# EAGLE design Sensor (EAGLE 7.6.0)

## Sheet 1 of 2
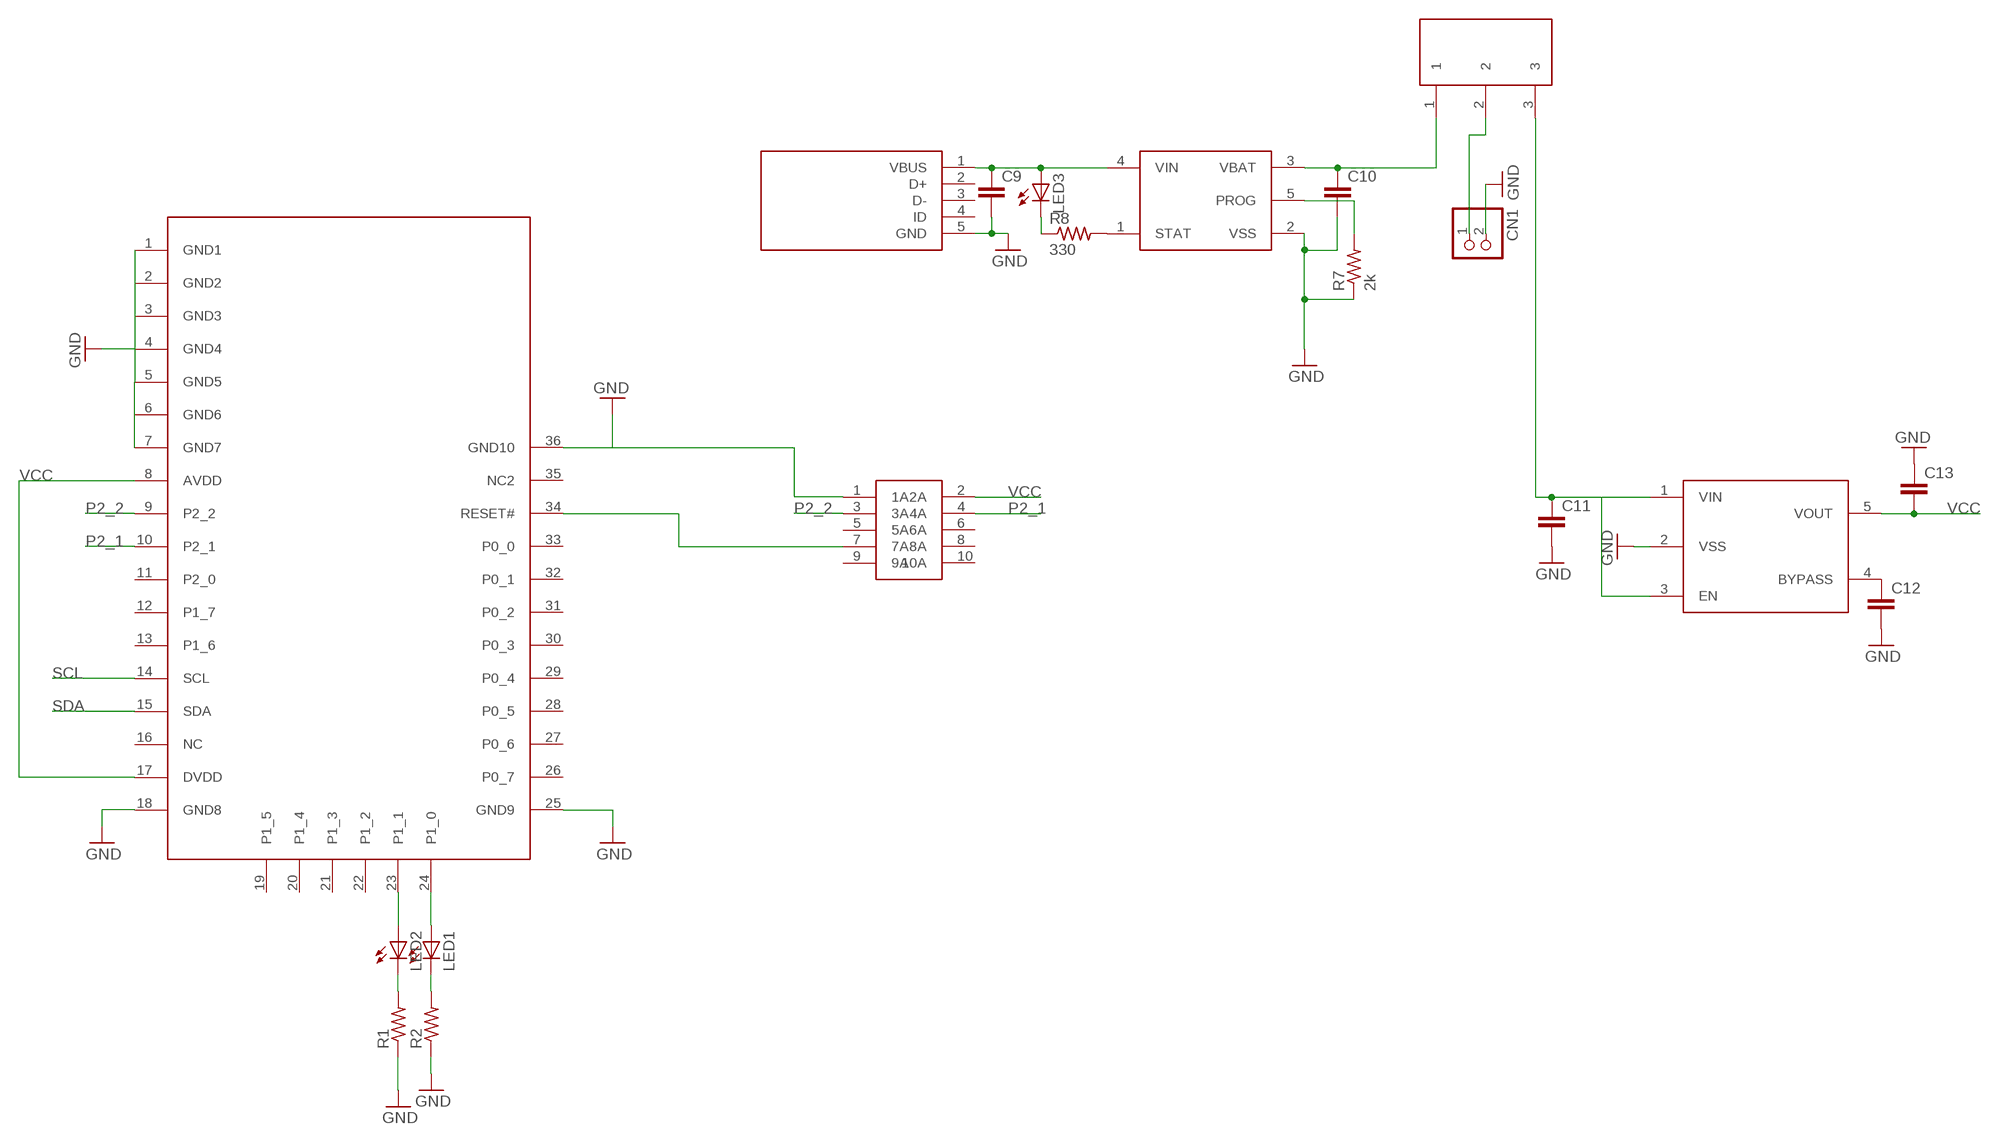
[diagram p0: schematic, sheet 1]

### Parts
C9  C-EUC0402  [C0402]
C10  C-EUC0402  [C0402]
C11  C-EUC0402  [C0402]
C12  C-EUC0402  [C0402]
C13  C-EUC0402  [C0402]
CN1  JST_2PIN-THM  [JST-PH-2-THM]
LED1  LEDCHIP-LED0805  [CHIP-LED0805]
LED2  LEDCHIP-LED0805  [CHIP-LED0805]
LED3  LEDCHIP-LED0805  [CHIP-LED0805]
R1  R-US_R0402  [R0402]
R2  R-US_R0402  [R0402]
R7  2k  R-US_R0402  [R0402]
R8  330  R-US_R0402  [R0402]
U$1  BLE113  [BLUEGIGA]
U$2  MCP73831  [SOT23-5L]
U$8  RIBBON_10POS_MALE  [RIBBON_10POS_MALE]
U$9  SPDT_THRU  [SPDT_THRU]
U$10  USB_MINI  [USB_MINI]
U$11  LP3985  [SOT23-5L]

### Nets
GND: C9.2 C10.2 C11.2 C12.2 C13.1 CN1.2 R1.1 R2.1 R7.1 U$1.1(GND1) U$1.2(GND2) U$1.3(GND3) U$1.4(GND4) U$1.5(GND5) U$1.6(GND6) U$1.7(GND7) U$1.18(GND8) U$1.25(GND9) U$1.36(GND10) U$2.2(VSS) U$8.1(1A) U$10.5(GND) U$11.2(VSS) ; also sheet 2
N$2: C9.1 LED3.A U$2.4(VIN) U$10.1(VBUS)
N$4: C10.1 U$2.3(VBAT) U$9.1
N$5: C11.1 U$9.3 U$11.1(VIN) U$11.3(EN)
N$6: U$1.34(RESET#) U$8.7(7A)
N$7: LED2.C R1.2
N$8: LED1.C R2.2
N$9: LED1.A U$1.24(P1_0)
N$10: LED2.A U$1.23(P1_1)
N$11: CN1.1 U$9.2
N$25: R7.2 U$2.5(PROG)
N$26: C12.1 U$11.4(BYPASS)
N$27: R8.2 U$2.1(STAT)
N$28: LED3.C R8.1
P2_1: U$1.10(P2_1) U$8.4(4A)
P2_2: U$1.9(P2_2) U$8.3(3A)
SCL: U$1.14(SCL) ; also sheet 2
SDA: U$1.15(SDA) ; also sheet 2
VCC: C13.2 U$1.8(AVDD) U$1.17(DVDD) U$8.2(2A) U$11.5(VOUT) ; also sheet 2
Unconnected: U$1.11(P2_0) U$1.12(P1_7) U$1.13(P1_6) U$1.16(NC) U$1.19(P1_5) U$1.20(P1_4) U$1.21(P1_3) U$1.22(P1_2) U$1.26(P0_7) U$1.27(P0_6) U$1.28(P0_5) U$1.29(P0_4) U$1.30(P0_3) U$1.31(P0_2) U$1.32(P0_1) U$1.33(P0_0) U$1.35(NC2) U$8.5(5A) U$8.6(6A) U$8.8(8A) U$8.9(9A) U$8.10(10A) U$10.2(D+) U$10.3(D-) U$10.4(ID)

## Sheet 2 of 2
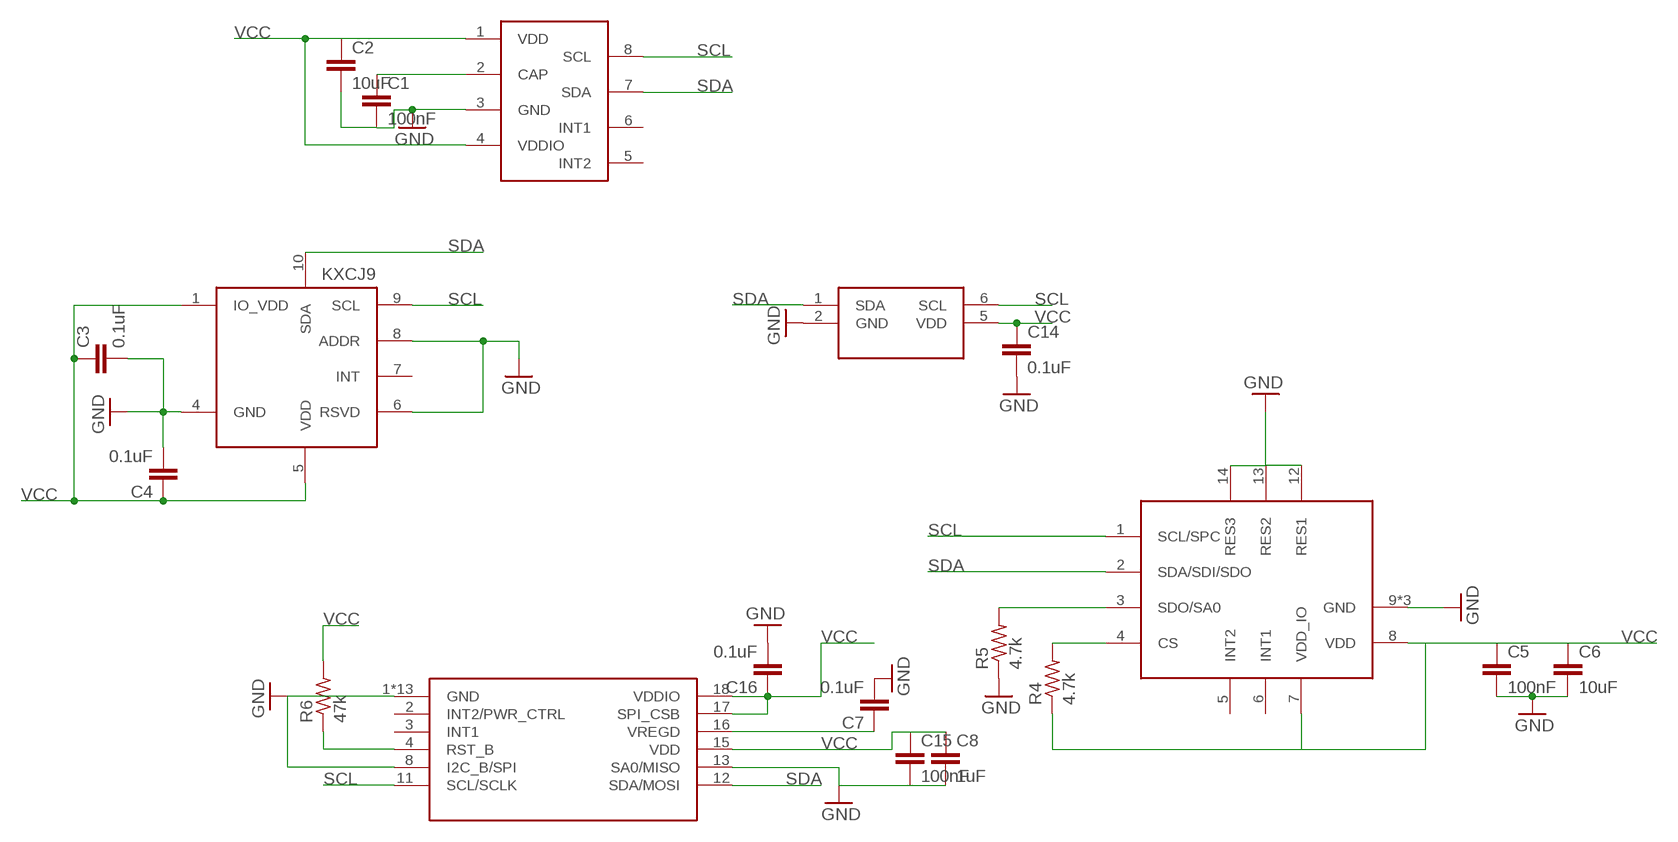
[diagram p1: schematic, sheet 2]

### Parts
ACCEL_16  LISDH_16G  [LGA14_2X2]
C1  100nF  C-EUC0402  [C0402]
C2  10uF  C-EUC0402  [C0402]
C3  0.1uF  C-EUC0402  [C0402]
C4  0.1uF  C-EUC0402  [C0402]
C5  100nF  C-EUC0402  [C0402]
C6  10uF  C-EUC0402  [C0402]
C7  0.1uF  C-EUC0402  [C0402]
C8  1uF  C-EUC0402  [C0402]
C14  0.1uF  C-EUC0402  [C0402]
C15  100nF  C-EUC0402  [C0402]
C16  0.1uF  C-EUC0402  [C0402]
R4  4.7k  R-US_R0402  [R0402]
R5  4.7k  R-US_R0402  [R0402]
R6  47k  R-US_R0402  [R0402]
U$12  KXCJ9  [KXCJ9]
U$13  MLP3115A2  [MLP3115A2]
U$14  FXAS21002  [FXAS21002]
U$15  SI7021-A20  [SI7021-A20]

### Nets
GND: ACCEL_16.9(GND) ACCEL_16.10(GND) ACCEL_16.11(GND) ACCEL_16.12(RES1) ACCEL_16.13(RES2) ACCEL_16.14(RES3) C1.2 C2.2 C3.2 C4.2 C5.2 C6.2 C7.2 C8.2 C14.2 C15.2 C16.2 R5.1 U$12.4(GND) U$12.6(RSVD) U$12.8(ADDR) U$13.3(GND) U$14.1(GND) U$14.5(GND) U$14.6(GND) U$14.7(GND) U$14.8(I2C_B/SPI) U$14.9(GND) U$14.10(GND) U$14.13(SA0/MISO) U$14.14(GND) U$14.19(GND) U$14.20(GND) U$14.21(GND) U$14.22(GND) U$14.23(GND) U$14.24(GND) U$15.2(GND) ; also sheet 1
N$14: C1.1 U$13.2(CAP)
N$15: ACCEL_16.4(CS) R4.2
N$17: ACCEL_16.3(SDO/SA0) R5.2
N$18: R6.1 U$14.4(RST_B)
N$19: C7.1 U$14.16(VREGD)
SCL: ACCEL_16.1(SCL/SPC) U$12.9(SCL) U$13.8(SCL) U$14.11(SCL/SCLK) U$15.6(SCL) ; also sheet 1
SDA: ACCEL_16.2(SDA/SDI/SDO) U$12.10(SDA) U$13.7(SDA) U$14.12(SDA/MOSI) U$15.1(SDA) ; also sheet 1
VCC: ACCEL_16.7(VDD_IO) ACCEL_16.8(VDD) C2.1 C3.1 C4.1 C5.1 C6.1 C8.1 C14.1 C15.1 C16.1 R4.1 R6.2 U$12.1(IO_VDD) U$12.5(VDD) U$13.1(VDD) U$13.4(VDDIO) U$14.15(VDD) U$14.17(SPI_CSB) U$14.18(VDDIO) U$15.5(VDD) ; also sheet 1
Unconnected: ACCEL_16.5(INT2) ACCEL_16.6(INT1) U$12.7(INT) U$13.5(INT2) U$13.6(INT1) U$14.2(INT2/PWR_CTRL) U$14.3(INT1)

## Library data of the parts
ACCEL_16 = Charles:LISDH_16G: MEMS Digital Output Motion Sensor -- 3-Axis Accelerometer 2/4/8/16g
C1-C16 = rcl:C-EU: CAPACITOR, European symbol
CN1 = adafruit:JST_2PIN: JST 2-Pin Connectors of various flavors SMT-RA (S2B-PH-SM4) 4UConnector #17311 SMT (B2B-PH-SM4) THM-RA (S2B-PH) THM (B2B-PH)
LED1-LED3 = adafruit:LED: LED OSRAM: - CHIPLED LG R971, LG N971, LY N971, LG Q971, LY Q971, LO R971, LY R971 LH N974, LH R974 LS Q976, LO Q976, LY Q976 LO Q996 - Hyper CHIPLED LW Q18S LB Q993, LB Q99A, LB R99A - SideLED LS A670, LO A670, LY A670, LG A670, LP A670 LB A673, LV A673, LT A673, LW A673 LH A674 LY A675 LS A676, LA A676, LO A676, LY A676, LW A676 LS A679, LY A679, LG A679 - Hyper Micro SIDELED® LS Y876, LA Y876, LO Y876, LY Y876 LT Y87S - SmartLED LW L88C, LW L88S LB L89C, LB L89S, LG L890 LS L89K, LO L89K, LY L89K LS L896, LA L896, LO L896, LY L896 - TOPLED LS T670, LO T670, LY T670, LG T670, LP T670 LSG T670, LSP T670, LSY T670, LOP T670, LYG T670 LG T671, LOG T671, LSG T671 LB T673, LV T673, LT T673, LW T673 LH T674 LS T676, LA T676, LO T676, LY T676, LB T676, LH T676, LSB T676, LW T676 LB T67C, LV T67C, LT T67C, LS T67K, LO T67K, LY T67K, LW E67C LS E67B, LA E67B, LO E67B, LY E67B, LB E67C, LV E67C, LT E67C LW T67C LS T679, LY T679, LG T679 LS T770, LO T770, LY T770, LG T770, LP T770 LB T773, LV T773, LT T773, LW T773 LH T774 LS E675, LA E675, LY E675, LS T675 LS T776, LA T776, LO T776, LY T776, LB T776 LHGB T686 LT T68C, LB T68C - Hyper Mini TOPLED® LB M676 - Mini TOPLED Santana® LG M470 LS M47K, LO M47K, LY M47K Source: http://www.osram.convergy.de/
R1 R2 R4-R8 = rcl:R-US_: RESISTOR, American symbol
U$1 = James_Updated:BLE113
U$2 = James_Updated:MCP73831
U$8 = James_Updated:RIBBON_10POS_MALE
U$9 = James_Updated:SPDT_THRU
U$10 = James_Updated:USB_MINI
U$11 = James_Updated:LP3985
U$12 = Charles:KXCJ9: Tri-Axis Digital Accelerometer (2g, 4g, 8g selectable)
U$13 = Charles:MLP3115A2: I2C Precision Altimeter
U$14 = Charles:FXAS21002: 3-Axis Digital Angular Rate Gyroscope (I2C/SPI)
U$15 = Charles:SI7021-A20

## Board
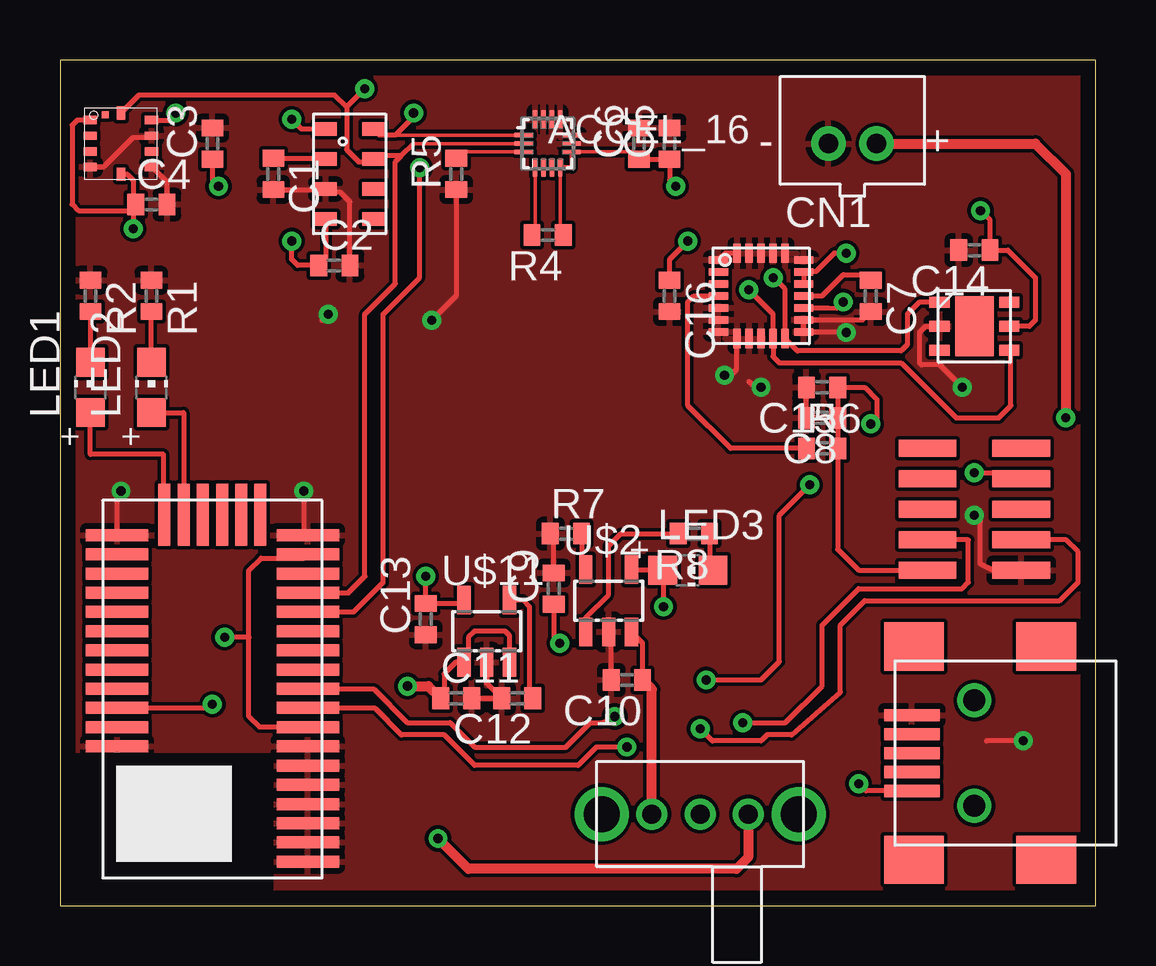
[diagram p2: board, top side]
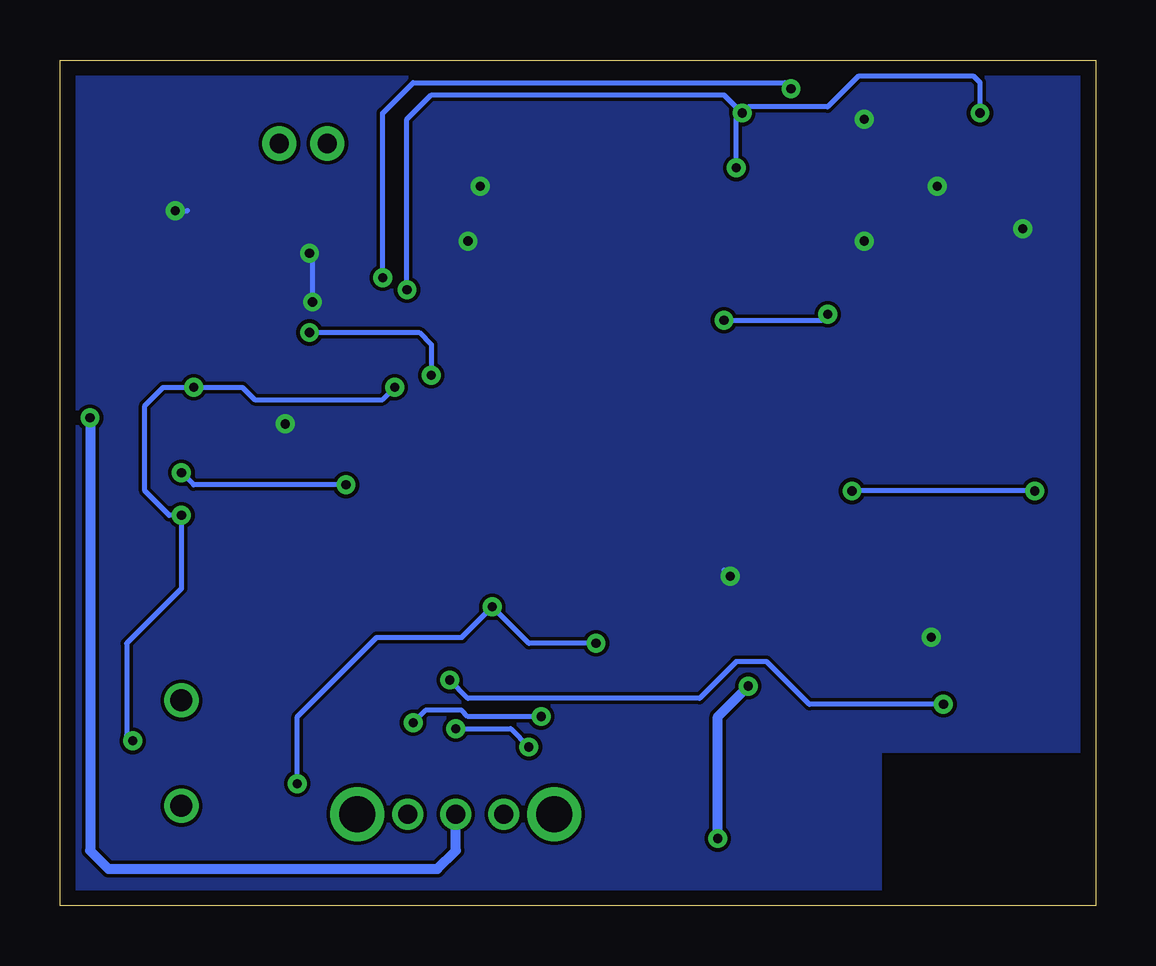
[diagram p3: board, bottom side, seen from below]

Size 43.16 x 35.23 mm. Coordinates in mm from the lower left corner, seen from the top.
Outline: 0,0 43.16,0 43.16,35.23 0,35.23 0,0
Copper layers (1*16): Top 0.035mm / dielectric 1.5mm / Bottom 0.035mm
Design rules "DRC_rules": minimum track width 8mil, minimum drill 15mil, track to track 6mil, track to pad 6mil, pad to pad 6mil, via to via 6mil, smd to smd 6mil, copper to edge 25mil, drill to drill 6mil, minimum pad ring 10mil, minimum via ring 8mil, stop-mask expansion 4mil, vias tented up to drill 0mil, thermal gap 10mil
tRestrict: area -0.3,0 to 8.9,6.3
bRestrict: area -0.3,0 to 8.9,6.3

### Footprints (pad centres in the part's own frame; a part is rotated, then mirrored left to right if it is on the bottom)
LGA14_2X2 = smd 0.79 x 0.19: 1 -0.995,0.35; 2 -0.995,0; 3 -0.995,-0.35; 8 0.995,-0.35; 9 0.995,0; 10 0.995,0.35 | smd 0.19 x 0.79: 4 -0.525,-0.995; 5 -0.175,-0.995; 6 0.175,-0.995; 7 0.525,-0.995; 11 0.525,0.995; 12 0.175,0.995; 13 -0.175,0.995; 14 -0.525,0.995
C0402 = smd 0.7 x 0.9: 1 -0.65,0; 2 0.65,0
JST-PH-2-THM = drill 0.8 pad 1.422: 1 1,0; 2 -1,0
CHIP-LED0805 = smd 1.2 x 1.2: A 0,-1.05; C 0,1.05
R0402 = smd 0.7 x 0.9: 1 -0.65,0; 2 0.65,0
BLUEGIGA = smd 2.6 x 0.5: 1 -3.975,9.6; 2 -3.975,8.8; 3 -3.975,8; 4 -3.975,7.2; 5 -3.975,6.4; 6 -3.975,5.6; 7 -3.975,4.8; 8 -3.975,4; 9 -3.975,3.2; 10 -3.975,2.4; 11 -3.975,1.6; 12 -3.975,0.8; 13 -3.975,0; 14 -3.975,-0.8; 15 -3.975,-1.6; 16 -3.975,-2.4; 17 -3.975,-3.2; 18 -3.975,-4; 25 3.975,-4; 26 3.975,-3.2; 27 3.975,-2.4; 28 3.975,-1.6; 29 3.975,-0.8; 30 3.975,0; 31 3.975,0.8; 32 3.975,1.6; 33 3.975,2.4; 34 3.975,3.2; 35 3.975,4; 36 3.975,4.8 | smd 0.5 x 2.6: 19 -2,-4.85; 20 -1.2,-4.85; 21 -0.4,-4.85; 22 0.4,-4.85; 23 1.2,-4.85; 24 2,-4.85
SOT23-5L = smd 0.55 x 1.2: 1 -0.95,-1.3; 2 0,-1.3; 3 0.95,-1.3; 4 0.95,1.3; 5 -0.95,1.3
RIBBON_10POS_MALE = smd 0.72 x 2.4: 1 -5.08,-1.95; 2 -5.08,1.95; 3 -3.81,-1.95; 4 -3.81,1.95; 5 -2.54,-1.95; 6 -2.54,1.95; 7 -1.27,-1.95; 8 -1.27,1.95; 9 0,-1.95; 10 0,1.95
SPDT_THRU = drill 0.787: 1 -2.007,0; 2 0,0; 3 2.007,0 | drill 1.499: A1 -4.102,0; A2 4.102,0
USB_MINI = smd 0.508 x 2.311: 1 -1.575,2.603; 2 -0.787,2.603; 3 0,2.603; 4 0.787,2.603; 5 1.575,2.603 | smd 2.007 x 2.489: S1 -4.445,2.515; S2 4.445,2.515; S3 -4.445,-2.997; S4 4.445,-2.997 | drill 0.914: S5 -2.197,0; S6 2.197,0
KXCJ9 = smd 0.55 x 0.35: 1 -1.275,0.975; 2 -1.275,0.325; 3 -1.275,-0.325; 4 -1.275,-0.975; 6 1.275,-0.975; 7 1.275,-0.325; 8 1.275,0.325; 9 1.275,0.975 | smd 0.35 x 0.55: 5 0,-1.275; 10 0,1.275 | smd 0.3 x 0.3: P$11 -0.65,1.2
MLP3115A2 = smd 0.95 x 0.55: 1 -1,1.875; 2 -1,0.625; 3 -1,-0.625; 4 -1,-1.875; 5 1,-1.875; 6 1,-0.625; 7 1,0.625; 8 1,1.875
FXAS21002 = smd 0.8 x 0.3: 1 -1.775,1.5; 2 -1.775,1; 3 -1.775,0.5; 4 -1.775,0; 5 -1.775,-0.5; 6 -1.775,-1; 7 -1.775,-1.5; 13 1.775,-1.5; 14 1.775,-1; 15 1.775,-0.5; 16 1.775,0; 17 1.775,0.5; 18 1.775,1; 19 1.775,1.5 | smd 0.3 x 0.8: 8 -1,-1.775; 9 -0.5,-1.775; 10 0,-1.775; 11 0.5,-1.775; 12 1,-1.775; 20 1,1.775; 21 0.5,1.775; 22 0,1.775; 23 -0.5,1.775; 24 -1,1.775
SI7021-A20 = smd 0.85 x 0.45: 1 -1.45,1; 2 -1.45,0; 3 -1.45,-1; 4 1.45,1; 5 1.45,0; 6 1.45,-1 | smd 1.6 x 2.5: P$7 0,0

### Placement (x,y rotation side)
ACCEL_16  20.32,31.75 0 top
C1  8.89,30.48 270 top
C2  11.43,26.67 0 top
C3  6.35,31.75 90 top
C4  3.81,29.21 0 top
C5  25.4,31.75 90 top
C6  24.13,31.75 90 top
C7  33.78,25.4 270 top
C8  31.75,20.32 180 top
C9  20.57,13.21 90 top
C10  23.62,9.4 180 top
C11  16.51,8.64 0 top
C12  19.05,8.64 180 top
C13  15.24,11.94 90 top
C14  38.1,27.3 180 top
C15  31.75,21.59 180 top
C16  25.4,25.4 270 top
CN1  33.02,31.75 0 top
LED1  1.27,21.59 0 top
LED2  3.81,21.59 0 top
LED3  26.16,13.97 270 top
R1  3.81,25.4 270 top
R2  1.27,25.4 270 top
R4  20.32,27.94 180 top
R5  16.51,30.48 90 top
R6  31.75,19.05 0 top
R7  21.08,15.49 0 top
R8  26.42,15.49 180 top
U$1  6.35,11.43 180 top
U$2  22.86,12.7 0 top
U$8  38.1,19.05 90 top
U$9  26.67,3.81 0 top
U$10  38.1,6.35 90 top
U$11  17.78,11.43 0 top
U$12  2.54,31.75 0 top
U$13  12.06,30.48 0 top
U$14  29.21,25.4 0 top
U$15  38.1,24.13 0 top

### Tracks (layer width: path | path; a pad name or v marks a point on that pad's centre or on a via)
GND  (via drill 0.38)
  Top 0.203: C4.2 4.46,30.13 U$12.6 | C2.2 12.08,29.32 11.68,29.72 11.2,29.72 U$13.3 11.04,29.83 C1.2 | C7.2 33.43,24.4 U$14.14 U$14.13 32.74,23.9 v32.77,23.88 | C8.2 C15.2 | C10.2 22.97,11.29 U$2.2 | C9.2 20.57,15.35 R7.1 | U$11.2 17.78,9.26 C12.2 C11.2 | C13.1 15.38,11.29 15.49,11.18 | U$12.4 1.82,30.77 3.05,32 3.74,32 U$12.8 | v37.59,21.59 36.65,22.53 35.89,22.53 35.81,22.61 35.81,23.88 36.07,24.13 U$15.2 | v29.21,21.59 28.96,21.59 28.7,21.84 | v27.69,22.1 27.94,22.1 28.19,22.35 28.19,23.61 U$14.8 | U$8.1 38.86,13.97 38.35,14.22 38.35,16 v38.1,16.26 | v40.13,6.86 38.61,6.86 | U$1.25 2.38,17.11 v2.54,17.27 | v10.16,17.27 10.16,15.6 U$1.18 | R5.1 16.51,25.4 v15.49,24.38 | v11.18,24.64 10.92,24.38 | U$14.24 27.71,27.18 U$14.1
  Bottom 0.203: v29.21,21.59 29.72,21.08 35.05,21.08 35.56,21.59 v37.59,21.59 38.86,21.59 39.62,20.83 39.62,17.27 38.61,16.26 v38.1,16.26 38.1,13.21 40.39,10.92 40.39,7.11 v40.13,6.86 | v32.77,23.88 28.19,23.88 27.69,23.37 v27.69,22.1 | v2.54,17.27 v10.16,17.27 | v15.49,24.38 11.43,24.38 v11.18,24.64
  pour Top: 0,0 0,35.31 43.18,35.31 43.18,0
N$2  (via drill 0.38)
  Top 0.203: U$2.4 25.08,14 LED3.A 25.15,13.94 v25.15,12.45 | U$10.1 33.58,4.78 v33.27,5.08 | C9.1 20.57,11.18 v20.83,10.92
  Bottom 0.203: v33.27,5.08 33.27,7.87 29.97,11.18 26.42,11.18 v25.15,12.45 23.62,10.92 v20.83,10.92
N$4
  Top 0.203: C10.1 24.27,10.94 U$2.3
  Top 0.406: U$9.1 24.66,9.01 C10.1
N$5  (via drill 0.38)
  Top 0.203: C11.1 16,8.78 16,9.65 16.48,10.13 U$11.1 17.02,10.32 17.02,11.18 17.27,11.43 18.54,11.43 18.73,11.24 U$11.3
  Top 0.406: U$9.3 28.68,2.01 28.19,1.52 17.02,1.52 v15.75,2.79 | v14.48,9.14 15.35,9.14 C11.1
  Bottom 0.406: v15.75,2.79 15.75,7.87 v14.48,9.14
N$6  (via drill 0.38)
  Top 0.203: U$1.34 6.2,8.23 v6.35,8.38 | v26.92,9.4 29.21,9.4 29.97,10.16 29.97,16.26 v31.24,17.53 | v38.1,18.03 39.8,18.03 U$8.7
  Bottom 0.203: v6.35,8.38 11.94,8.38 13.72,10.16 14.99,10.16 16.51,8.64 26.16,8.64 v26.92,9.4 | v31.24,17.53 37.59,17.53 v38.1,18.03
N$7
  Top 0.203: LED2.C R1.2
N$8
  Top 0.203: R2.2 LED1.C
N$9
  Top 0.203: U$1.24 4.32,16.28 4.32,18.8 1.27,18.8 LED1.A
N$10
  Top 0.203: LED2.A 5.15,20.54 U$1.23
N$11  (via drill 0.38)
  Top 0.406: CN1.1 40.64,31.75 41.91,30.48 v41.91,20.32
  Bottom 0.406: v41.91,20.32 41.91,2.29 41.15,1.52 27.43,1.52 26.67,2.29 U$9.2
N$14
  Top 0.203: U$13.2 8.91,31.11 C1.1
N$15
  Top 0.152: ACCEL_16.4 19.8,28.07
  Top 0.203: 19.8,28.07 R4.2
N$17
  Top 0.152: ACCEL_16.3 16.78,31.4
  Top 0.203: 16.51,30.99 R5.2 16.78,31.4
N$18
  Top 0.203: R6.1 27.94,19.05 26.16,20.83 26.16,25.15 26.42,25.4 U$14.4
N$19
  Top 0.203: U$14.16 31.75,25.4 32.64,26.29 33.64,26.29 C7.1
N$25
  Top 0.203: R7.2 21.73,14.18 U$2.5
N$26
  Top 0.203: U$11.4 19.27,12.73 19.56,12.45 19.56,8.78 C12.1
N$27
  Top 0.203: U$2.1 21.91,12 22.86,12.95 22.86,14.99 23.37,15.49 R8.2
N$28
  Top 0.203: R8.1 27.07,14.12 LED3.C
P2_1  (via drill 0.38)
  Top 0.203: U$1.10 13.07,9.03 14.48,7.62 16.26,7.62 17.27,6.6 21.08,6.6 22.1,7.62 22.61,7.62 v23.11,7.87 | U$8.4 37.85,15.24 37.85,13.46 37.59,13.21 33.27,13.21 31.75,11.68 31.75,9.14 30.23,7.62 v28.45,7.62
  Bottom 0.203: v28.45,7.62 27.94,8.13 26.42,8.13 26.16,7.87 v23.11,7.87
P2_2  (via drill 0.38)
  Top 0.203: U$1.9 13.11,8.23 14.22,7.11 16,7.11 17.27,5.84 21.59,5.84 22.35,6.6 v23.62,6.6 | U$8.3 41.91,15.24 42.42,14.73 42.42,13.46 41.66,12.7 33.53,12.7 32.51,11.68 32.51,8.89 30.48,7.11 29.46,7.11 29.21,6.86 27.18,6.86 v26.67,7.37
  Bottom 0.203: v26.67,7.37 24.38,7.37 v23.62,6.6
SCL  (via drill 0.38)
  Top 0.152: ACCEL_16.1 13.97,32.1
  Top 0.203: U$13.8 13.32,32.1 13.97,32.1 14.73,32.86 v14.73,33.02 | U$15.6 39.62,23.06 39.62,20.83 39.12,20.32 37.34,20.32 35.05,22.61 29.97,22.61 29.71,22.87 U$14.11 29.71,24.65 v28.7,25.65 | U$1.14 12.23,12.23 13.46,13.46 13.46,24.64 14.99,26.16 v14.99,30.73 | U$12.9 4.53,32.73 v4.83,33.02
  Bottom 0.203: v14.99,30.73 14.99,32.77 v14.73,33.02 | v28.7,25.65 28.7,32.77 27.69,33.78 15.49,33.78 v14.73,33.02 | v4.83,33.02 4.83,34.29 5.08,34.54 9.91,34.54 11.18,33.27 14.48,33.27 v14.73,33.02
SDA  (via drill 0.38)
  Top 0.152: ACCEL_16.2 14.73,31.75
  Top 0.203: 14.73,31.75 14.22,31.24 | 14.22,31.24 13.2,31.24 U$13.7 12.95,30.99 12.45,30.99 11.94,31.5 11.94,33.27 | U$12.10 3.3,33.78 11.43,33.78 11.94,33.27 | U$1.15 12.01,13.03 12.7,13.72 12.7,24.64 13.97,25.91 13.97,30.99 14.22,31.24 | v29.72,26.16 30.21,25.67 U$14.12 30.72,23.11 35.05,23.11 35.31,23.37 35.31,24.64 35.8,25.13 U$15.1 | v12.7,34.04 11.94,33.27
  Bottom 0.203: v29.72,26.16 29.72,33.02 28.45,34.29 12.95,34.29 v12.7,34.04
VCC  (via drill 0.38)
  Top 0.152: ACCEL_16.7 20.84,28.07 | ACCEL_16.8 23.83,31.4
  Top 0.203: U$12.1 0.72,32.73 0.51,32.51 0.51,29.21 0.76,28.96 2.91,28.96 C4.1 3.05,29.32 | U$12.5 2.8,30.48 3.05,30.23 3.05,29.32 | U$13.4 11.06,26.95 C2.1 9.91,26.67 9.65,26.92 v9.65,27.69 | 20.84,28.07 R4.1 21.08,27.94 | 23.83,31.4 C6.1 C5.1 25.4,30.23 v25.65,29.97 | U$15.5 40.39,24.13 40.64,24.38 40.64,26.16 39.5,27.3 C14.1 38.75,28.56 v38.35,28.96 | U$8.2 33.27,13.97 32.4,14.84 R6.2 C8.1 C15.1 33.53,21.59 34.04,21.08 34.04,20.32 v33.78,20.07 | U$11.5 16.69,12.59 C13.2 v15.24,13.72 | U$1.8 8.32,7.43 7.87,7.87 7.87,11.18 | 7.87,11.18 7.87,13.97 8.38,14.48 10.17,14.48 U$1.17 | 3.05,29.32 v3.05,28.19 | C3.1 6.35,30.23 v6.6,29.97 | U$13.1 10.06,32.35 v9.65,32.77 | ACCEL_16.7 21.32,30.75 21.34,30.73 21.34,31.38 ACCEL_16.8 | C16.1 25.4,26.92 v26.16,27.69 | U$14.17 U$14.18 31,26.42 31.5,26.42 32.26,27.18 v32.77,27.18 | U$14.15 32,24.9 32.38,24.89 v32.64,25.15 | 7.87,11.18 v6.86,11.18
  Bottom 0.203: v3.05,28.19 2.79,28.19 | v6.6,29.97 6.86,29.97 | v9.65,32.77 9.4,32.77 | v9.65,27.69 9.4,27.69 | v26.16,27.69 25.91,27.69 | v25.65,29.97 25.91,29.97 | v32.64,25.15 32.64,26.92 v32.77,27.18 | v6.86,11.18 6.86,11.43 | v38.35,28.96 37.85,28.96 | v33.78,20.07 33.53,20.07 | v15.24,13.72 15.49,13.97
  pour Bottom: 0,0 0,35.31 43.18,35.31 43.18,0